# EAGLE design RFID (EAGLE 8.3.1)
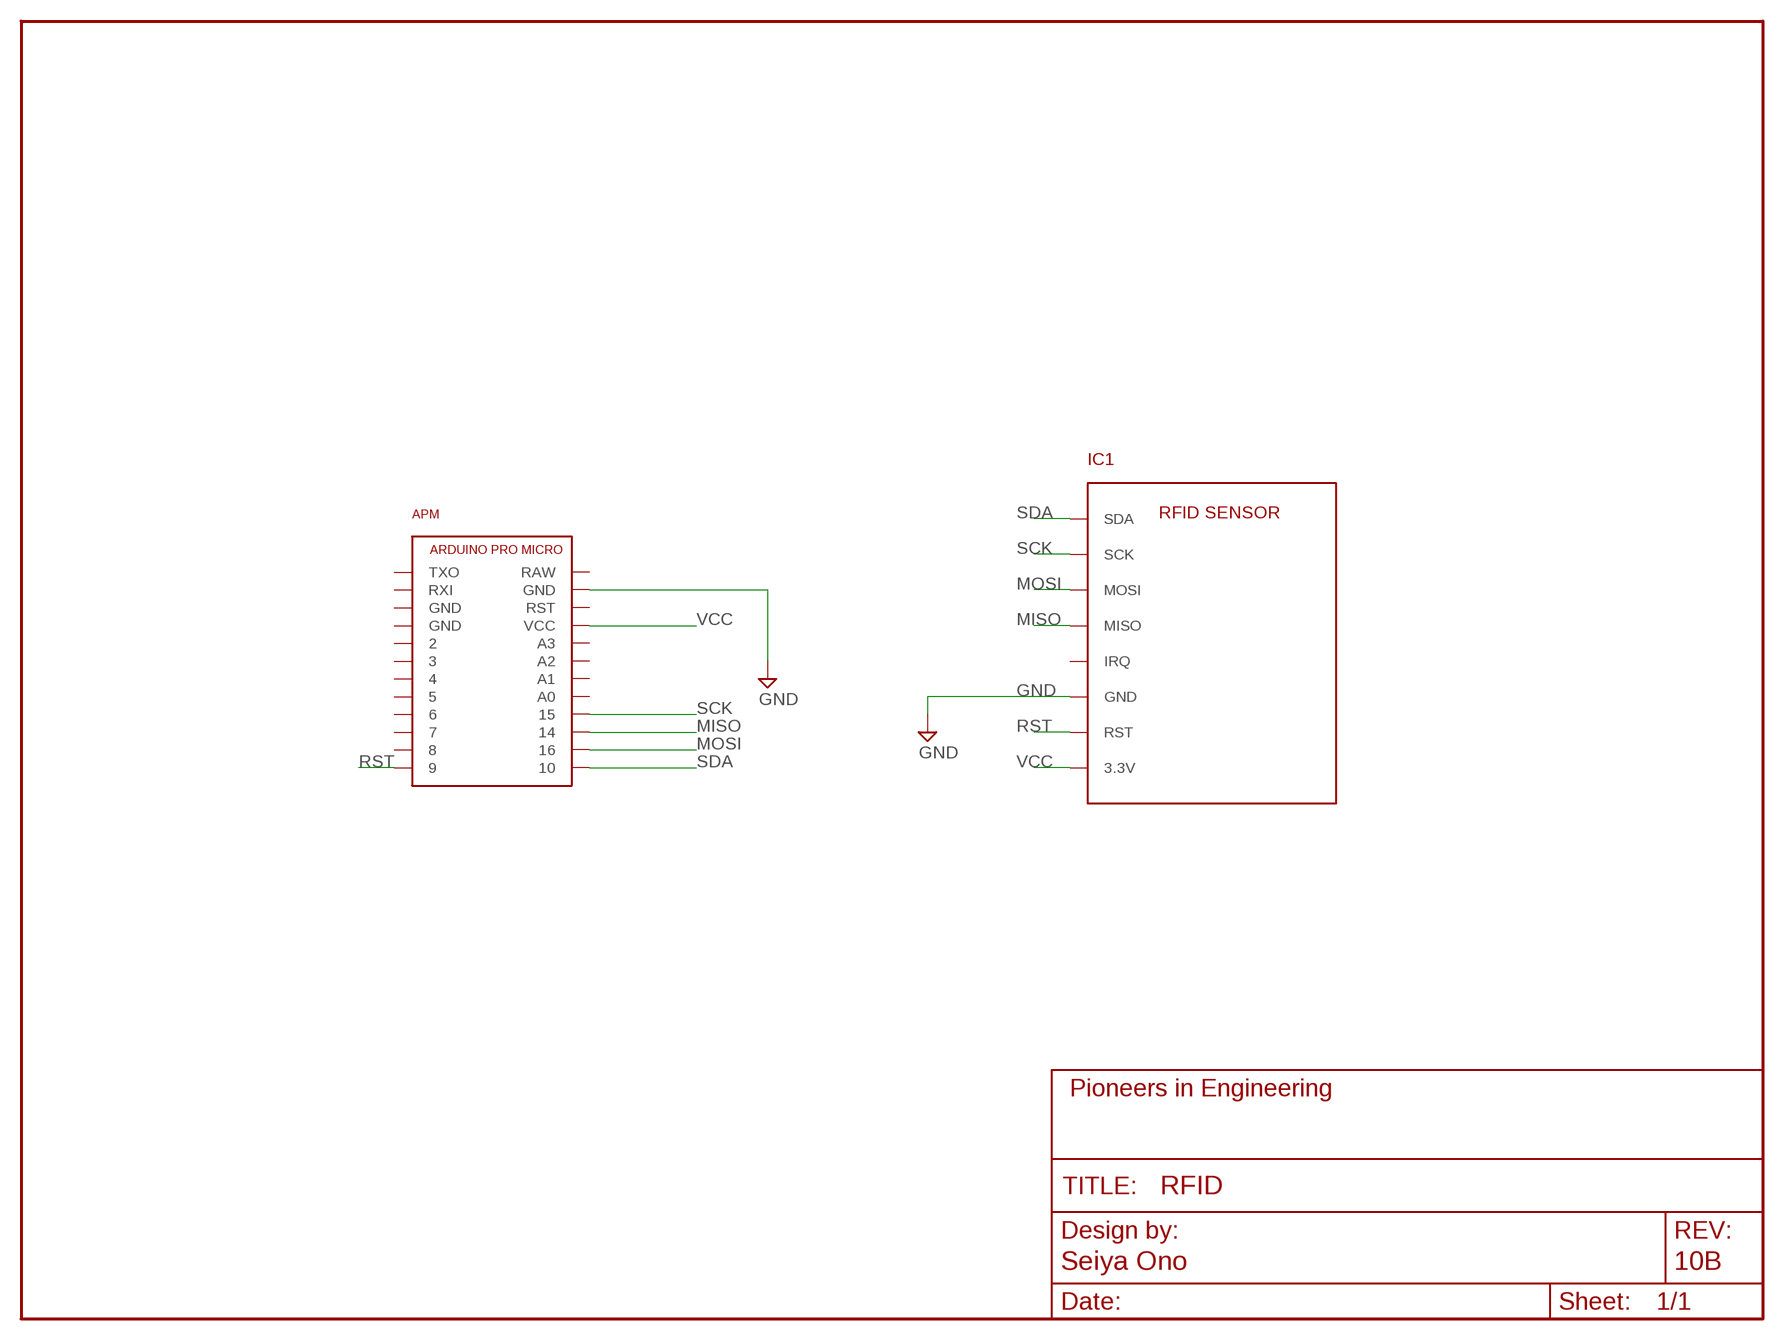
[diagram p0: schematic, sheet 1]
FRAME1 (FRAME_SCHEMATIC): AUTHOR: Seiya Ono; REVISION: 10B

## Parts
APM  ARDUINO_PRO_MICRO  [ARDUINO_PRO_MICRO]
IC1  RFID_SENSOR  [RFID_SENSOR]

## Nets
GND: APM.GND@2(GND) IC1.GND
MISO: APM.14 IC1.MISO
MOSI: APM.16 IC1.MOSI
RST: APM.9 IC1.RST
SCK: APM.15 IC1.SCK
SDA: APM.10 IC1.SDA
VCC: APM.VCC IC1.3.3V
Unconnected: APM.2 APM.3 APM.4 APM.5 APM.6 APM.7 APM.8 APM.A0 APM.A1 APM.A2 APM.A3 APM.GND@0(GND) APM.GND@1(GND) APM.RAW APM.RST APM.RXI APM.TXO IC1.IRQ

## Library data of the parts
APM = pie:ARDUINO_PRO_MICRO: Arduino Pro Micro Electrical System Year 9's Smart Sensor Core Pin Outs <https://cdn.sparkfun.com/assets/9/c/3/c/4/523a1765757b7f5c6e8b4567.png> Buy Here <http://www.aliexpress.com/item/Mini-Leonardo-Pro-Micro-ATmega32U4-5V-16MHz-Module-For-Arduino-Best-Quality/32284746884.html?ws_ab_test=searchweb201556_8,searchweb201602_2_10057_10056_10065_10055_10054_10067_10069_10059_10058_10017_10070_10060_10061_10052_10062_10053_10050_10051,searchweb201603_1&btsid=45993952-29ca-4de4-a0fb-c7fb72b8e1a5> Thru Hole Female Pins <http://www.digikey.com/product-search/en?keywords=929974E-01-12-ND> Surface Mount Female Pins <http://www.digikey.com/product-detail/en/sullins-connector-solutions/NPTC121KFXC-RC/S5604-ND/776062>; DESCRIPTION: Arduino Pro Micro; DISTRIBUTOR: AliExpress; DISTRIBUTOR_PART_NUMBER: 32284746884; MANUFACTURER: Feiyang electronics; NOTES: https://www.aliexpress.com/item/Mini-Leonardo-Pro-Micro-ATmega32U4-5V-16MHz-Module-For-Arduino-Best-Quality/32284746884.html?ws_ab_test=searchweb201556_8,searchweb201602_2_10057_10056_10065_10055_10054_10067_10069_10059_10058_10017_10070_10060_10061_10052_10062_10053_10050_10051,searchweb201603_1&btsid=45993952-29ca-4de4-a0fb-c7fb72b8e1a5; PACKAGE: ARDUINO_PRO_MICRO; REFERENCE_DEST: ARDUINO_PRO_MICRO
IC1 = pie:RFID_SENSOR: RFID Sensor AliExpress <https://www.aliexpress.com/item/High-Quality-MFRC-522-RC522-RFID-Reader-RF-IC-Card-Inductive-Sensor-Module-For-Arduino-Module/32657638702.html?spm=2114.01010208.3.1.ePefNj&ws_ab_test=searchweb201556_0%2Csearchweb201602_5_10057_10056_10065_10068_10055_10067_10054_10069_10059_10058_418_10073_10017_10070_10060_10061_10052_10062_10053_10050_10051%2Csearchweb201603_7&btsid=cb39fcb9-9ace-4eec-a43a-83949f44e6b2>; DISTRIBUTOR: AliExpress; DISTRIBUTOR_PART_NUMBER: 32657638702; MANUFACTURER: Binling Gooding; NOTES: https://www.aliexpress.com/item/High-Quality-MFRC-522-RC522-RFID-Reader-RF-IC-Card-Inductive-Sensor-Module-For-Arduino-Module/32657638702.html?spm=2114.01010208.3.1.ePefNj&ws_ab_test=searchweb201556_0%2Csearchweb201602_5_10057_10056_10065_10068_10055_10067_10054_10069_10059_10058_418_10073_10017_10070_10060_10061_10052_10062_10053_10050_10051%2Csearchweb201603_7&btsid=cb39fcb9-9ace-4eec-a43a-83949f44e6b2; PACKAGE: RFID_SENSOR

## Board
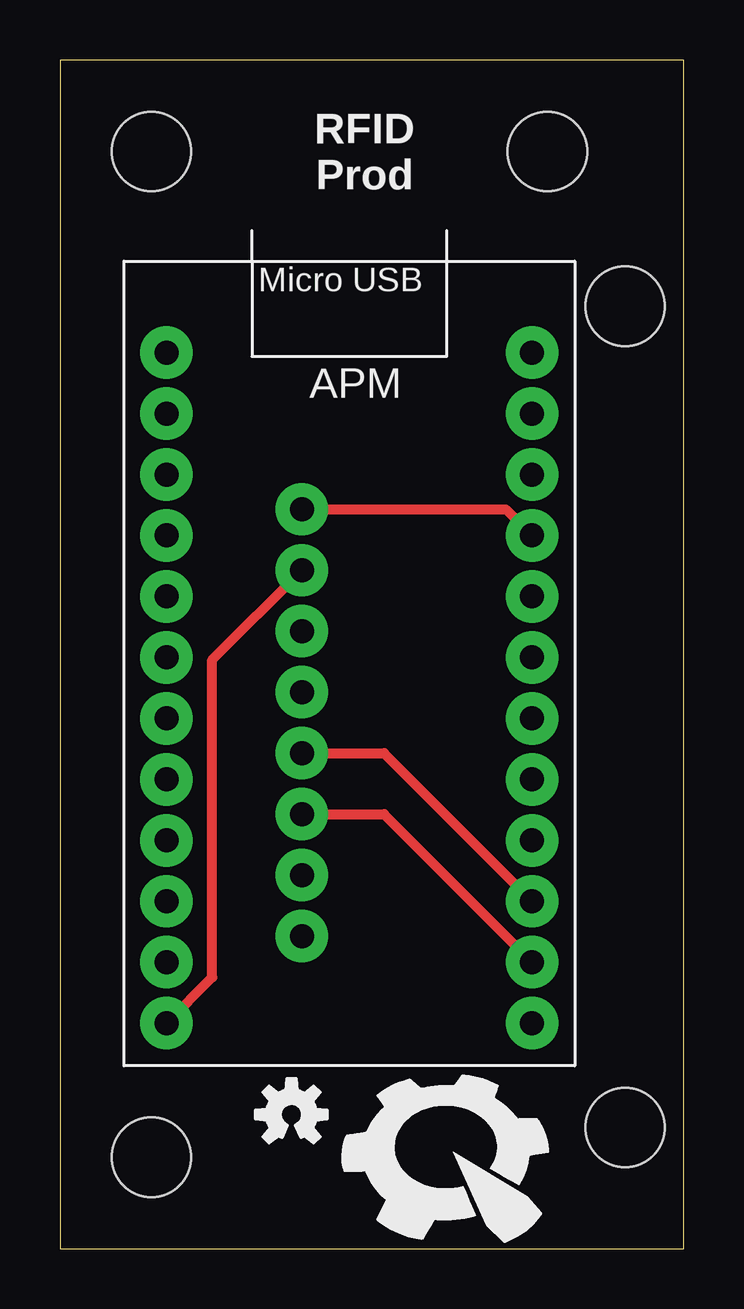
[diagram p1: board, top side]
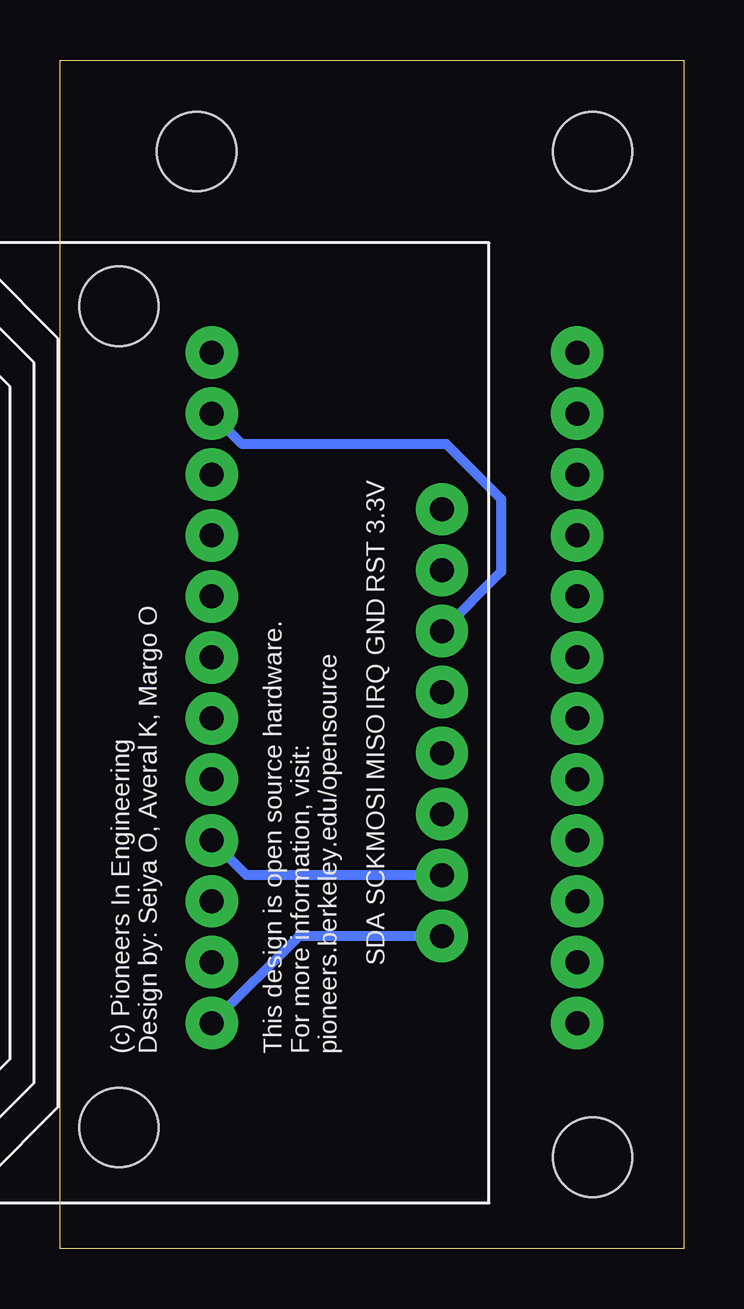
[diagram p2: board, bottom side, seen from below]

Size 26.02 x 49.53 mm. Coordinates in mm from the lower left corner, seen from the top.
Outline: 0,0 26.02,0 26.02,49.53 0,49.53 0,0
Copper layers (1*16): Top 2mil / dielectric 9mil / Bottom 2mil
Design rules "pie": minimum track width 6mil, minimum drill 15mil, track to track 6mil, track to pad 6mil, pad to pad 6mil, via to via 6mil, smd to smd 6mil, copper to edge 25mil, drill to drill 7mil, minimum pad ring 7mil, minimum via ring 7mil, stop-mask expansion 3mil, vias tented up to drill 21mil, thermal gap 10mil

### Footprints (pad centres in the part's own frame; a part is rotated, then mirrored left to right if it is on the bottom)
ARDUINO_PRO_MICRO = drill 1 pad 2.184: 2 1.778,19.558; 3 1.778,17.018; 4 1.778,14.478; 5 1.778,11.938; 6 1.778,9.398; 7 1.778,6.858; 8 1.778,4.318; 9 1.778,1.778; 10 17.018,1.778; 14 17.018,6.858; 15 17.018,9.398; 16 17.018,4.318; A0 17.018,11.938; A1 17.018,14.478; A2 17.018,17.018; A3 17.018,19.558; GND@0 1.778,24.638; GND@1 1.778,22.098; GND@2 17.018,27.178; RAW 17.018,29.718; RST 17.018,24.638; RXI 1.778,27.178; TXO 1.778,29.718; VCC 17.018,22.098
RFID_SENSOR = drill 1 pad 2.184: 3.3V 11.1,59; GND 16.18,59; IRQ 18.72,59; MISO 21.26,59; MOSI 23.8,59; RST 13.64,59; SCK 26.34,59; SDA 28.88,59 | hole 3.302: 2.642,45.529; 36.855,45.529
STAND-OFF = hole 3.302: 0,0

### Placement (x,y rotation side)
APM  2.67,7.62 0 top
IC1  69.09,41.91 270 bottom
U$1  [PIE-LOGO-SMALL]  16.38,4.06 0 top
U$2  [STAND-OFF]  3.81,3.81 180 top
U$3  [STAND-OFF]  3.81,45.72 180 top
U$4  [STAND-OFF]  20.32,45.72 180 top
U$5  [OSHW-LOGO-S]  9.65,5.59 0 top

### Tracks (layer width: path | path; a pad name or v marks a point on that pad's centre or on a via)
GND
  Bottom 0.406: IC1.GND 7.62,28.2 7.62,31.24 9.91,33.53 18.41,33.53 APM.GND@2
MISO
  Top 0.406: APM.14 13.51,20.65 IC1.MISO
MOSI
  Top 0.406: APM.16 13.51,18.11 IC1.MOSI
RST
  Top 0.406: APM.9 6.35,11.3 6.35,24.53 IC1.RST
SCK
  Bottom 0.406: APM.15 18.24,15.57 IC1.SCK
SDA
  Bottom 0.406: APM.10 16.05,13.03 IC1.SDA
VCC
  Top 0.406: APM.VCC 18.59,30.81 IC1.3.3V

### Text on the board
tPlace: RFID / Prod
bNames: This design is open source hardware. / For more information, visit: / pioneers.berkeley.edu/opensource | (c) Pioneers In Engineering / Design by: Seiya O, Averal K, Margo O